# Altium schematic sheet Fri3d_2024_Exp0-Frame_00.SchDoc: Exp0-Frame
size A3; Date: 22/06/2023; DrawnBy: Wim Van Gool; DocumentNumber: 1; Revision: 00; SheetNumber: 1; SheetTotal: 1
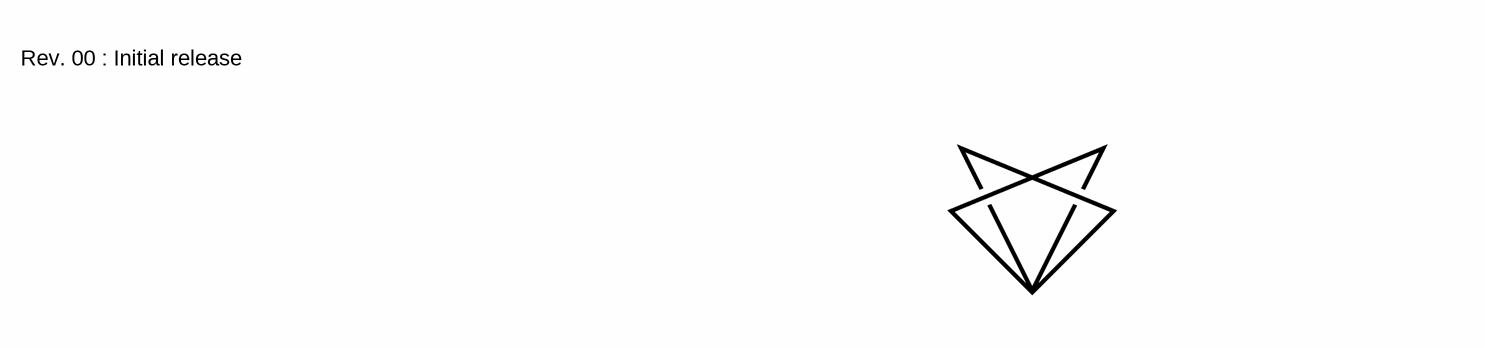
[diagram p0: Fri3d_2024_Exp0-Frame_00.SchDoc]

## Notes on the sheet
- Rev. 00 : Initial release
- Title
- Revision
- Date
- Dranw By
- Size
- A3
- Sheet
- of